# EAGLE design signalMapper (EAGLE 7.3.0)
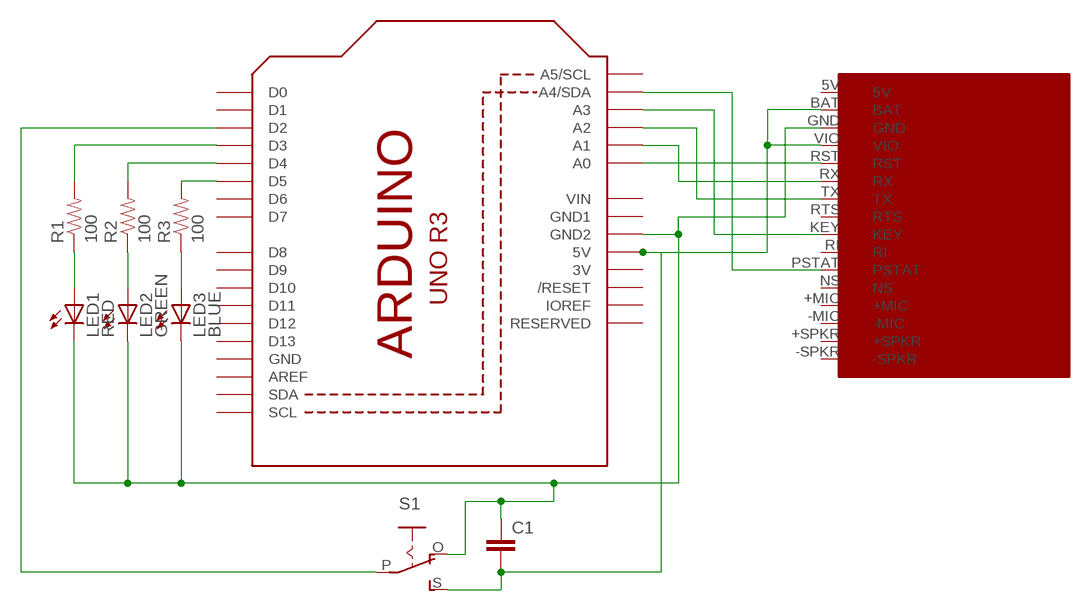
[diagram p0: schematic, sheet 1]

## Parts
C1  CAPPTH  [CAP-PTH-SMALL]
LED1  RED  LED5MM  [LED5MM]
LED2  GREEN  LED5MM  [LED5MM]
LED3  BLUE  LED5MM  [LED5MM]
R1  100  100OHM-1/4W-1%(PTH)  [AXIAL-0.3]
R2  100  100OHM-1/4W-1%(PTH)  [AXIAL-0.3]
R3  100  100OHM-1/4W-1%(PTH)  [AXIAL-0.3]
S1  EG1218S  [EG1218]
U1  ARDUINOR3-BPLACE  [ARDUINOR3-BPLACE]
U$1  ADAFRUIT_FONA808  [ADAFRUIT_FONA808]

## Nets
N$1: U1.A0 U$1.RST
N$2: U1.A1 U$1.RX
N$3: U1.A2 U$1.TX
N$4: U1.A3 U$1.KEY
N$5: U1.A4(A4/SDA) U$1.PSTAT
N$7: C1.2 S1.S U1.5V U$1.BAT U$1.VIO
N$8: R1.P$2 U1.D3
N$9: R2.P$2 U1.D4
N$10: R3.P$2 U1.D5
N$11: LED1.A R1.P$1
N$12: LED2.A R2.P$1
N$13: LED3.A R3.P$1
N$14: S1.P U1.D2
N$15: C1.1 LED1.K(C) LED2.K(C) LED3.K(C) S1.O U1.GND2 U$1.GND
Unconnected: U1.A5(A5/SCL) U1.AREF U1.D0 U1.D1 U1.D6 U1.D7 U1.D8 U1.D9 U1.D10 U1.D11 U1.D12 U1.D13 U1.IOREF U1.RESERVED U1.RESET(/RESET) U1.SCL U1.SDA U$1.+MIC U$1.+SPKR U$1.-MIC U$1.-SPKR U$1.NS U$1.RI U$1.RTS

## Power pins joined to a net without a drawn wire
3V: U1.3V
5V: U$1.5V
GND: U1.GND
GND1: U1.GND1
VIN: U1.VIN

## Library data of the parts
C1 = SparkFun-Capacitors:CAP: Capacitor Standard 0603 ceramic capacitor, and 0.1" leaded capacitor.
LED1-LED3 = adafruit:LED: LED OSRAM: - CHIPLED LG R971, LG N971, LY N971, LG Q971, LY Q971, LO R971, LY R971 LH N974, LH R974 LS Q976, LO Q976, LY Q976 LO Q996 - Hyper CHIPLED LW Q18S LB Q993, LB Q99A, LB R99A - SideLED LS A670, LO A670, LY A670, LG A670, LP A670 LB A673, LV A673, LT A673, LW A673 LH A674 LY A675 LS A676, LA A676, LO A676, LY A676, LW A676 LS A679, LY A679, LG A679 - Hyper Micro SIDELED® LS Y876, LA Y876, LO Y876, LY Y876 LT Y87S - SmartLED LW L88C, LW L88S LB L89C, LB L89S, LG L890 LS L89K, LO L89K, LY L89K LS L896, LA L896, LO L896, LY L896 - TOPLED LS T670, LO T670, LY T670, LG T670, LP T670 LSG T670, LSP T670, LSY T670, LOP T670, LYG T670 LG T671, LOG T671, LSG T671 LB T673, LV T673, LT T673, LW T673 LH T674 LS T676, LA T676, LO T676, LY T676, LB T676, LH T676, LSB T676, LW T676 LB T67C, LV T67C, LT T67C, LS T67K, LO T67K, LY T67K, LW E67C LS E67B, LA E67B, LO E67B, LY E67B, LB E67C, LV E67C, LT E67C LW T67C LS T679, LY T679, LG T679 LS T770, LO T770, LY T770, LG T770, LP T770 LB T773, LV T773, LT T773, LW T773 LH T774 LS E675, LA E675, LY E675, LS T675 LS T776, LA T776, LO T776, LY T776, LB T776 LHGB T686 LT T68C, LB T68C - Hyper Mini TOPLED® LB M676 - Mini TOPLED Santana® LG M470 LS M47K, LO M47K, LY M47K Source: http://www.osram.convergy.de/
R1-R3 = SparkFun-Resistors:100OHM-1/4W-1%(PTH): RES-12181; PROD_ID: RES-12181
S1 = adafruit:EG1218: SLIDING SWITCH 0.1" spacing through hole, vertical SPDT slide switch http://www.ladyada.net/library/pcb/eaglelibrary.html
U1 = adafruit:ARDUINOR3: This is a new object for the new Arduino R3 - with extra pins that you may want to use (such as IOref, and duplicated A4/A5
U$1 = dai-maker-lab:ADAFRUIT_FONA808

## Board
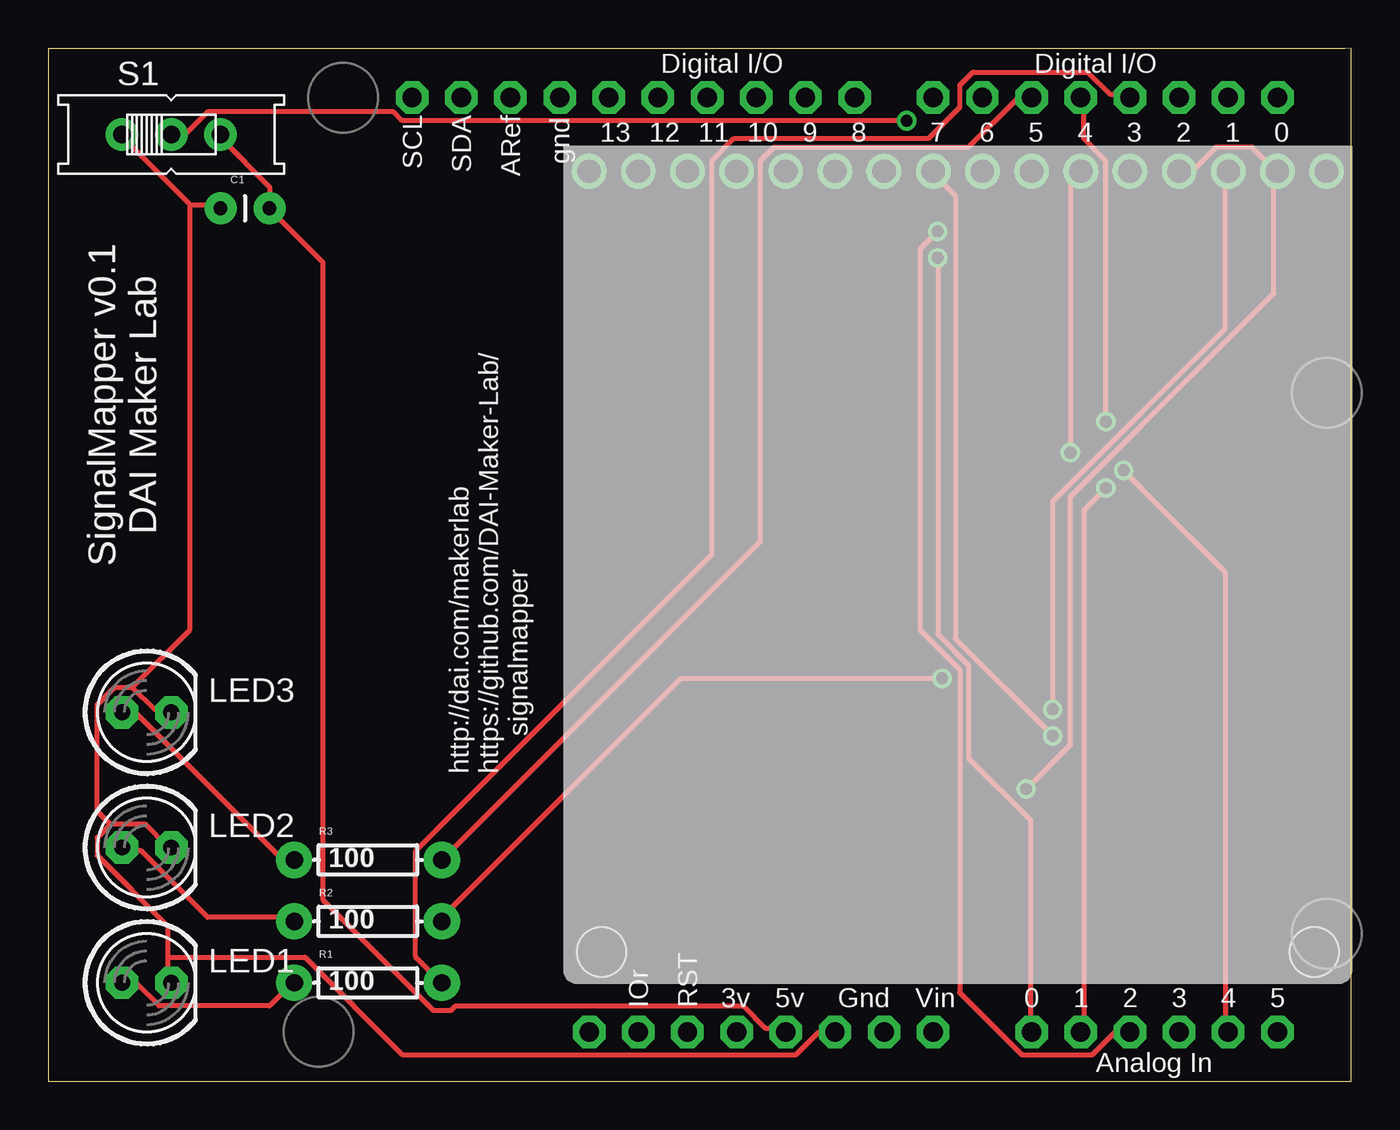
[diagram p1: board, top side]
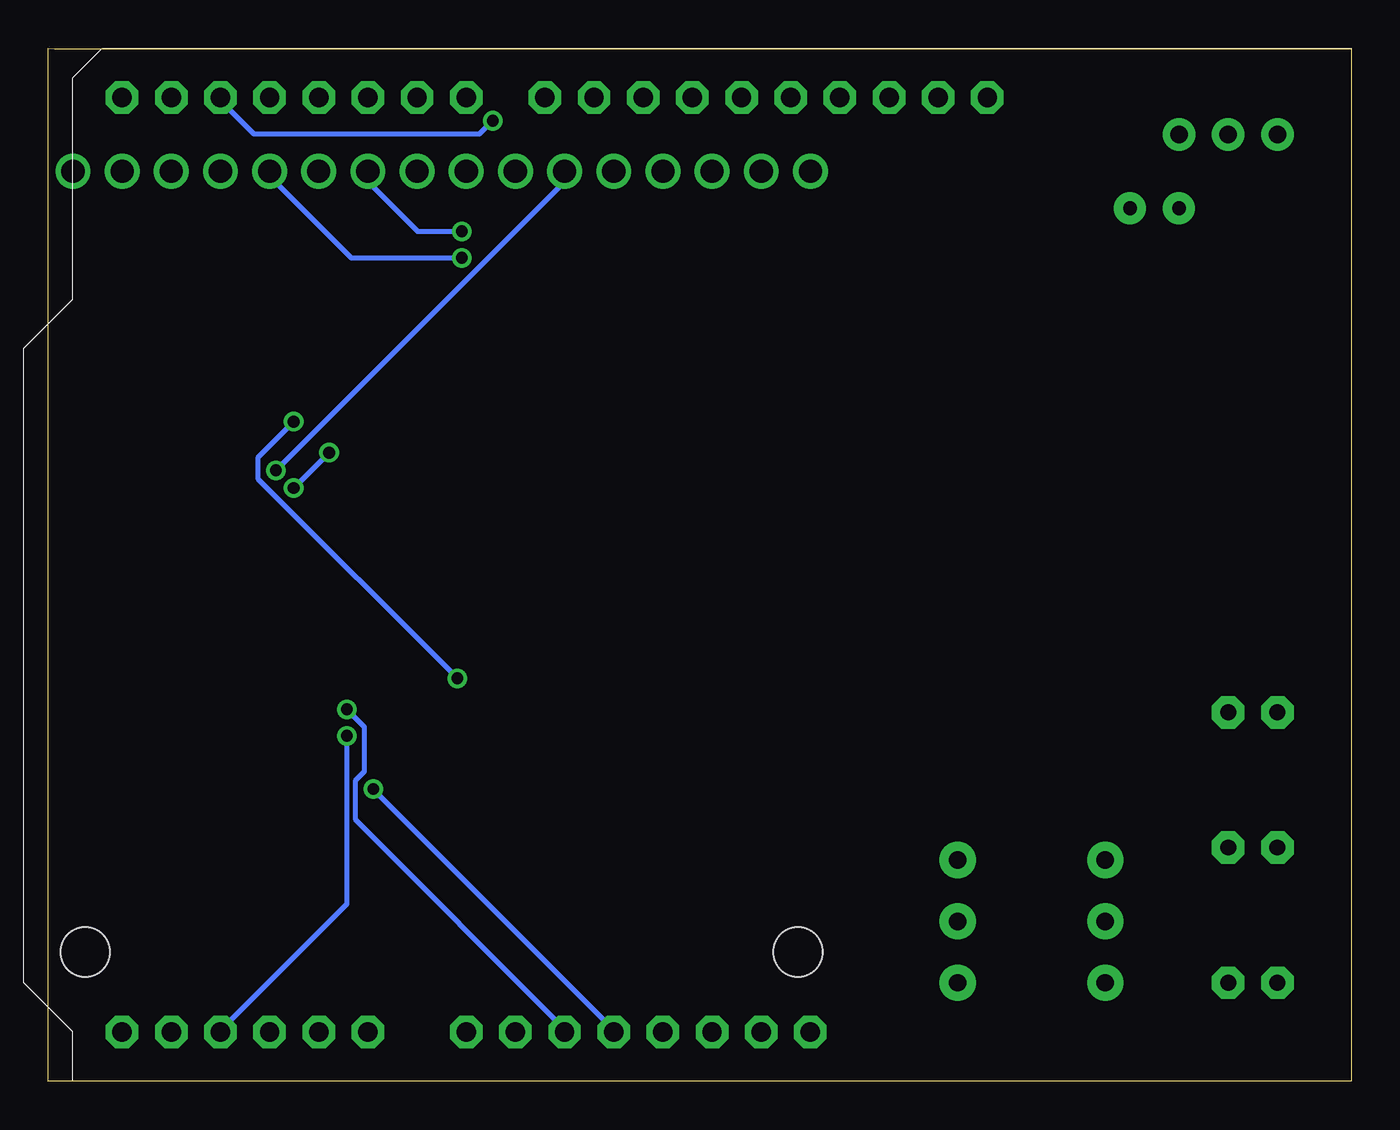
[diagram p2: board, bottom side, seen from below]

Size 67.31 x 53.34 mm. Coordinates in mm from the lower left corner, seen from the top.
Outline: 0,0 67.31,0 67.31,53.34 66.98,53.33 0,53.33 0,0
Copper layers (1*16): Top 0.035mm / dielectric 1.5mm / Bottom 0.035mm
Design rules "default": minimum track width 10mil, minimum drill 24mil, track to track 8mil, track to pad 8mil, pad to pad 8mil, via to via 8mil, smd to smd 8mil, copper to edge 40mil, drill to drill 8mil, minimum pad ring 10mil, minimum via ring 8mil, stop-mask expansion 4mil, vias tented up to drill 0mil, thermal gap 10mil

### Footprints (pad centres in the part's own frame; a part is rotated, then mirrored left to right if it is on the bottom)
CAP-PTH-SMALL = drill 0.7 pad 1.651: 1 0,0; 2 2.54,0
LED5MM = drill 0.813 pad 1.676 octagon: A -1.27,0; K 1.27,0
AXIAL-0.3 = drill 0.9 pad 1.88: P$1 -3.81,0; P$2 3.81,0
EG1218 = drill 0.9 pad 1.676: O -2.54,0; P 0,0; S 2.54,0
ARDUINOR3-BPLACE = drill 1 pad 1.676 octagon: 3V 35.56,2.54; 5V 38.1,2.54; A0 50.8,2.54; A1 53.34,2.54; A2 55.88,2.54; A3 58.42,2.54; A4 60.96,2.54; A5 63.5,2.54; AREF 23.876,50.8; D0 63.5,50.8; D1 60.96,50.8; D2 58.42,50.8; D3 55.88,50.8; D4 53.34,50.8; D5 50.8,50.8; D6 48.26,50.8; D7 45.72,50.8; D8 41.656,50.8; D9 39.116,50.8; D10 36.576,50.8; D11 34.036,50.8; D12 31.496,50.8; D13 28.956,50.8; GND 26.416,50.8; GND1 43.18,2.54; GND2 40.64,2.54; IOREF 30.48,2.54; RESERVED 27.94,2.54; RESET 33.02,2.54; SCL 18.796,50.8; SDA 21.336,50.8; VIN 45.72,2.54
ADAFRUIT_FONA808 = drill 1.2: 5V -19.05,-20.32; +MIC 11.43,-20.32; +SPKR 16.51,-20.32; -MIC 13.97,-20.32; -SPKR 19.05,-20.32; BAT -16.51,-20.32; GND -13.97,-20.32; KEY 1.27,-20.32; NS 8.89,-20.32; PSTAT 6.35,-20.32; RI 3.81,-20.32; RST -8.89,-20.32; RTS -1.27,-20.32; RX -6.35,-20.32; TX -3.81,-20.32; VIO -11.43,-20.32 | hole 2.54: -18.415,20.003; 18.415,20.003

### Placement (x,y rotation side)
C1  8.89,45.09 0 top
LED1  5.08,5.08 0 top
LED2  5.08,12.06 0 top
LED3  5.08,19.05 0 top
R1  16.51,5.08 0 top
R2  16.51,8.26 0 top
R3  16.51,11.43 0 top
S1  6.35,48.9 0 top
U1  0,0 0 top
U$1  46.99,26.67 180 top

### Tracks (layer width: path | path; a pad name or v marks a point on that pad's centre or on a via)
N$1  (via drill 0.61)
  Top 0.254: v45.95,42.52 45.95,23.09 47.55,21.49 47.55,16.69 50.75,13.49 50.75,2.74 U1.A0
  Bottom 0.254: v45.95,42.52 51.66,42.52 56.01,46.86 U$1.RST
N$2  (via drill 0.61)
  Top 0.254: v54.63,30.63 53.49,29.49 53.49,2.74 U1.A1 | v52.81,32.46 52.81,46.41 53.26,46.86 U$1.RX
  Bottom 0.254: v52.81,32.46 v54.63,30.63
N$3  (via drill 0.61)
  Top 0.254: v45.95,43.89 45.03,42.98 45.03,23.32 47.09,21.26 47.09,4.57 50.29,1.37 53.95,1.37 55.09,2.52 55.78,2.52 U1.A2
  Bottom 0.254: v45.95,43.89 48.23,43.89 50.75,46.41 50.75,46.86 U$1.TX
N$4  (via drill 0.61)
  Top 0.254: v51.89,17.83 46.86,22.86 46.86,45.72 45.72,46.86 U$1.KEY
  Bottom 0.254: v51.89,17.83 51.89,9.14 58.29,2.74 U1.A3
N$5  (via drill 0.61)
  Top 0.254: v55.55,31.55 60.81,26.29 60.81,2.74 U1.A4
  Bottom 0.254: v55.55,31.55 40.69,46.41 40.69,46.86 U$1.PSTAT
N$7  (via drill 0.61)
  Top 0.254: U$1.VIO 58.52,47.09 59.21,47.09 60.35,48.23 62.18,48.23 63.32,47.09 U$1.BAT 63.32,46.86 63.32,40.69 52.81,30.18 52.81,17.37 v50.52,15.09 | S1.S 8.91,48.69 11.43,46.18 C1.2 11.43,45.03 14.17,42.29 14.17,9.37 19.89,3.66 20.8,3.66 21.03,3.89 35.89,3.89 37.03,2.74 37.95,2.74 U1.5V
  Bottom 0.254: v50.52,15.09 38.18,2.74 U1.5V
N$8
  Top 0.254: U1.D3 55.78,50.98 54.86,50.98 53.72,52.12 47.78,52.12 47.09,51.44 47.09,50.29 45.49,48.69 35.43,48.69 34.29,47.55 34.29,27.2 18.97,11.89 18.97,6.4 20.12,5.26 R1.P$2
N$9  (via drill 0.61)
  Top 0.254: v54.63,34.06 54.63,47.55 53.49,48.69 53.49,50.75 U1.D4 | v46.18,20.8 32.69,20.8 20.34,8.46 R2.P$2
  Bottom 0.254: v54.63,34.06 56.46,32.23 56.46,31.09 v46.18,20.8
N$10
  Top 0.254: U1.D5 50.75,50.75 50.06,50.75 47.55,48.23 37.49,48.23 36.8,47.55 36.8,27.89 20.34,11.43 R3.P$2
N$11
  Top 0.254: LED1.A 3.89,5.03 4.57,5.03 5.71,3.89 11.43,3.89 12.57,5.03 R1.P$1
N$12
  Top 0.254: LED2.A 3.89,11.89 4.8,11.89 8.23,8.46 12.57,8.46 R2.P$1
N$13
  Top 0.254: R3.P$1 12.12,11.43 4.57,18.97 3.89,18.97 LED3.A
N$14  (via drill 0.61)
  Top 0.254: v44.35,49.61 18.29,49.61 17.83,50.06 8.23,50.06 7.09,48.92 6.4,48.92 S1.P
  Bottom 0.254: v44.35,49.61 45.03,48.92 56.69,48.92 58.52,50.75 U1.D2
N$15  (via drill 0.61)
  Top 0.254: 7.32,45.26 8.69,45.26 C1.1 | 7.32,45.26 3.89,48.69 S1.O | 6.17,6.4 6.17,8 2.52,11.66 2.52,12.57 3.2,13.26 | 6.17,6.4 6.17,5.26 LED1.K | 3.2,13.26 5.03,13.26 6.17,12.12 LED2.K | 4.34,20.34 5.49,19.2 6.17,19.2 LED3.K | 4.34,20.34 3.43,20.34 2.52,19.43 2.52,13.95 3.2,13.26 | 6.17,6.4 13.26,6.4 18.29,1.37 38.63,1.37 39.78,2.52 40.46,2.52 U1.GND2 | v51.89,19.2 51.89,29.95 60.81,38.86 60.81,46.86 U$1.GND | 7.32,45.26 7.32,23.32 4.34,20.34
  Bottom 0.254: v51.89,19.2 50.98,18.29 50.98,16 51.44,15.54 51.44,13.49 40.69,2.74 U1.GND2

### Text on the board
tPlace: SignalMapper v0.1 / DAI Maker Lab | http://dai.com/makerlab / https://github.com/DAI-Maker-Lab/ / signalmapper